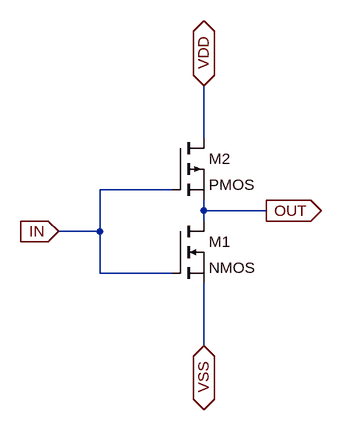
[diagram p0: schematic inverter.asc]
inverter.asc, the LTspice schematic file:
Version 4
SHEET 1 880 680
WIRE 240 16 240 -64
WIRE 192 96 80 96
WIRE 240 128 240 112
WIRE 336 128 240 128
WIRE 240 144 240 128
WIRE 80 160 80 96
WIRE 80 160 16 160
WIRE 80 224 80 160
WIRE 192 224 80 224
WIRE 240 336 240 240
FLAG 336 128 OUT
IOPIN 336 128 Out
FLAG 16 160 IN
IOPIN 16 160 In
FLAG 240 -64 VDD
IOPIN 240 -64 BiDir
FLAG 240 336 VSS
IOPIN 240 336 BiDir
SYMBOL nmos 192 144 R0
SYMATTR InstName M1
SYMBOL pmos 192 16 R0
SYMATTR InstName M2

The netlist it stands for:
* inverter.asc
M1 OUT IN VSS VSS NMOS
M2 VDD IN OUT OUT PMOS
.model NMOS NMOS
.model PMOS PMOS
.lib standard.mos
.backanno
.end